# Altium schematic sheet ui_cpu_power.SchDoc: mcHF Pro Transceiver UI board
size A3; Author: Krassi Atanassov; CompanyName: MØNKA; Engineer: For radio amateurs experimentation, non-commercial use only. Thank you!; Revision: 0.8.5; SheetTotal: 13
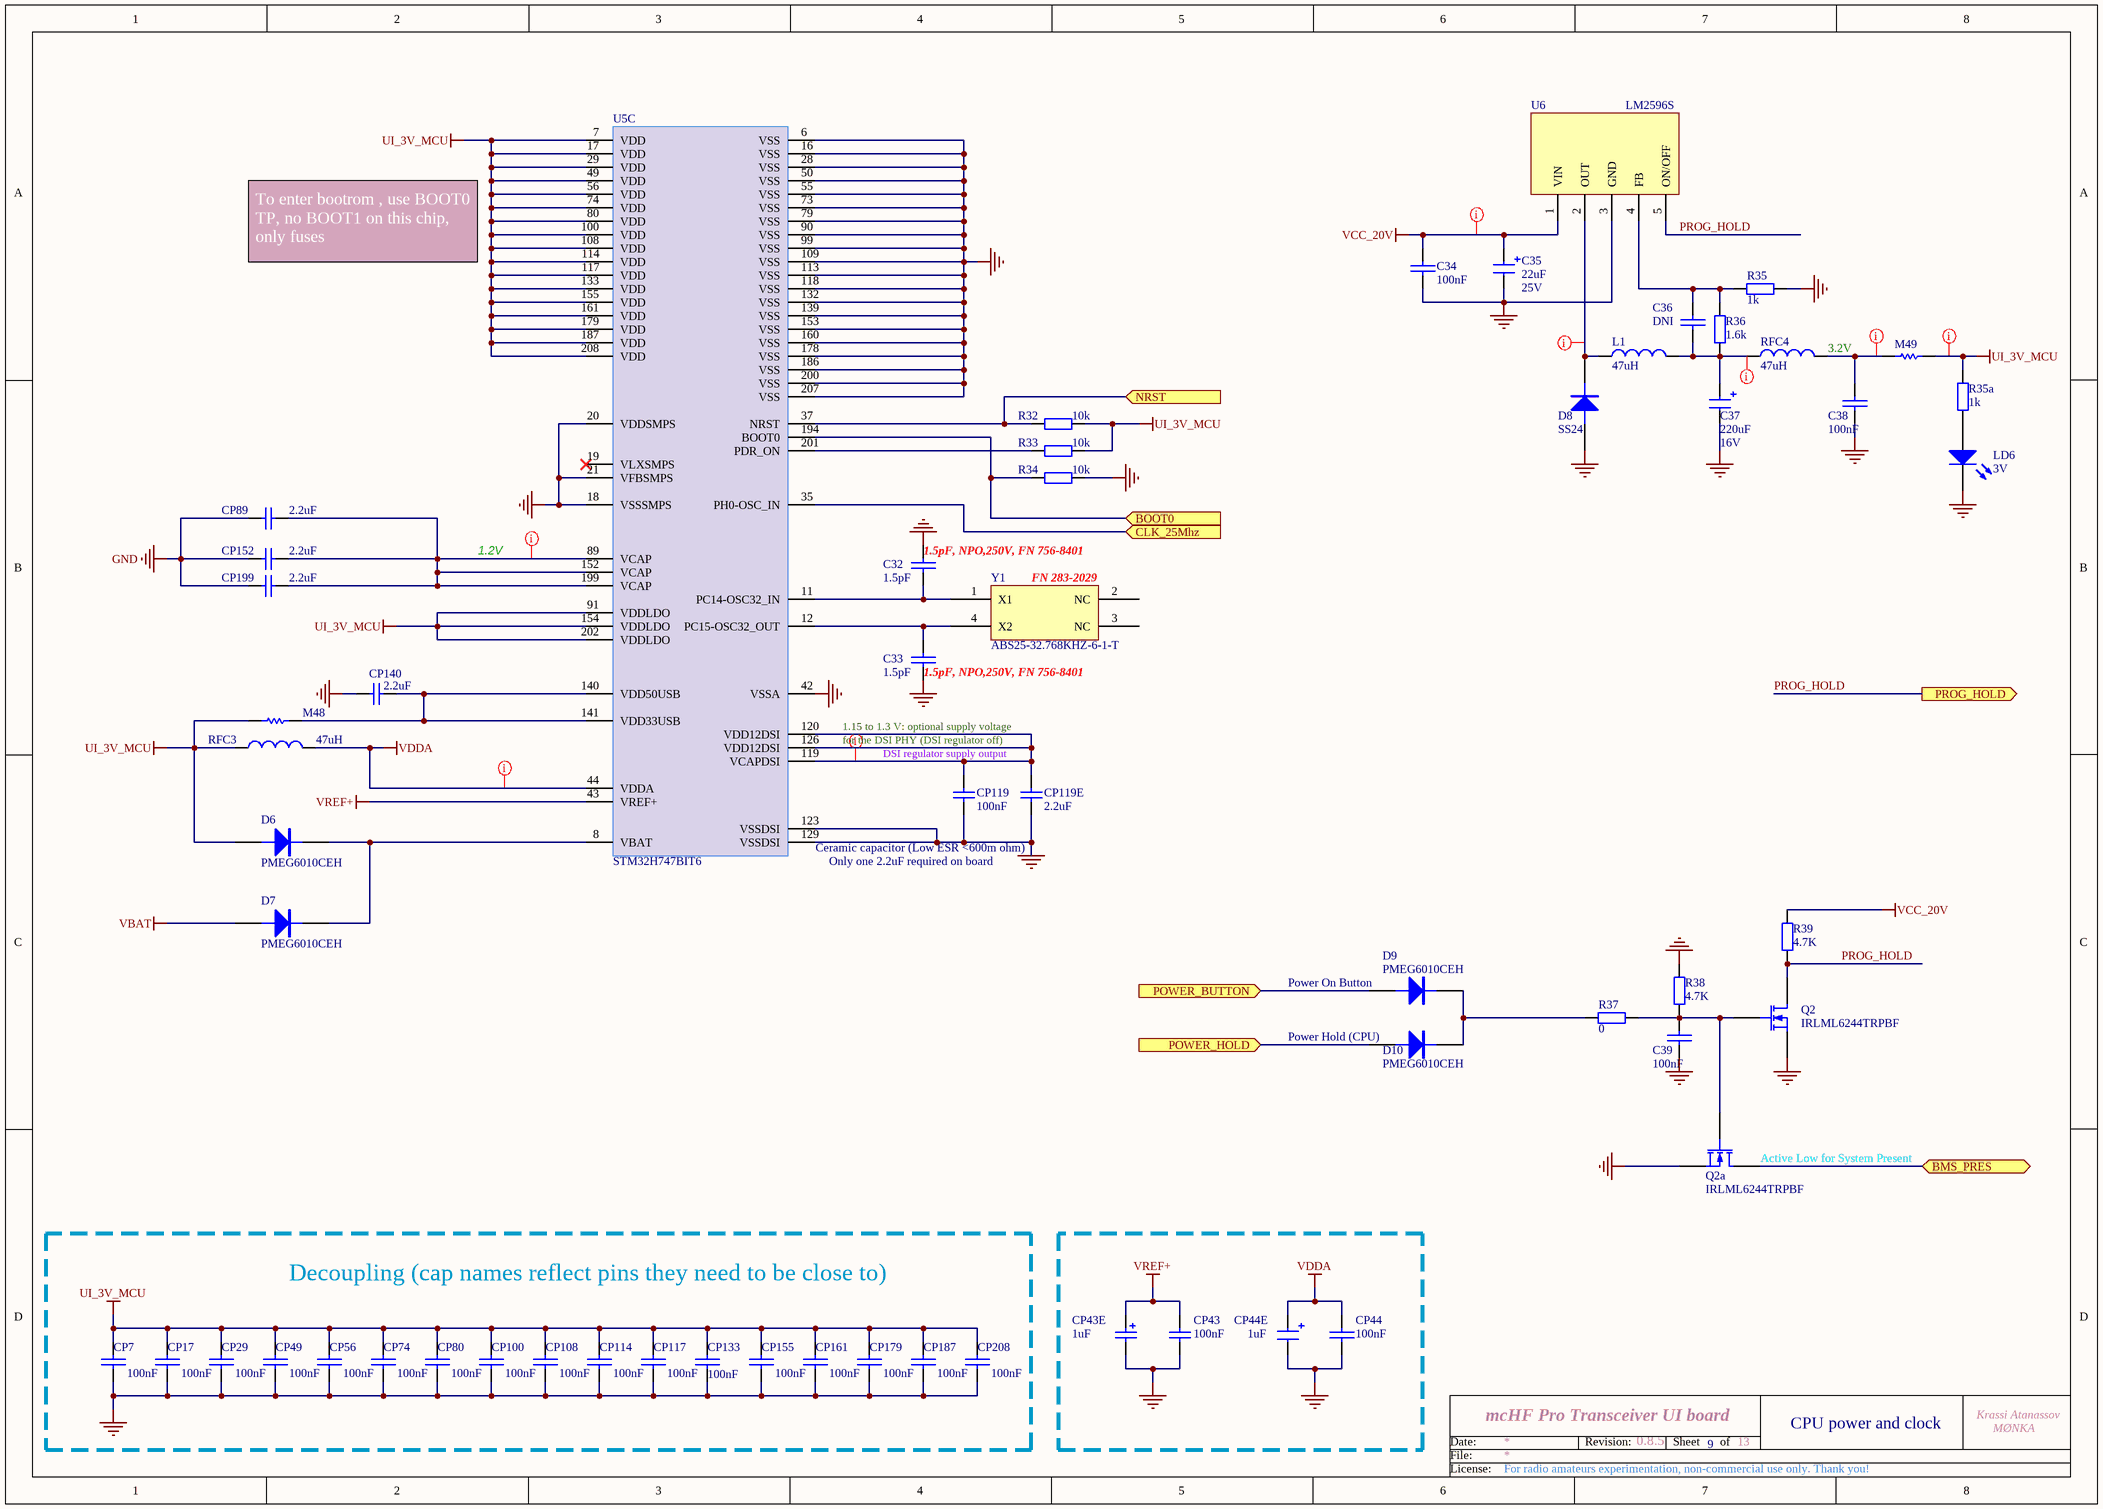
[diagram p0: ui_cpu_power.SchDoc]

## Parts
C32  1.5pF  [0805]
C33  1.5pF  [0805]
C34  100nF  [0805]
C35  22uF  Voltage: 25V  [1206_Elec_Cap]
C36  DNI  [0805]  (no BOM)
C37  220uF  Voltage: 16V  [CAP_ALUM_Pro]
C38  100nF  [0805]
C39  100nF  [0805]
CP7  100nF  [0805]
CP17  100nF  [0805]
CP29  100nF  [0805]
CP43  100nF  [0805]
CP43E  1uF  [1206_Elec_Cap]
CP44  100nF  [0805]
CP44E  1uF  [1206_Elec_Cap]
CP49  100nF  [0805]
CP56  100nF  [0805]
CP74  100nF  [0805]
CP80  100nF  [0805]
CP89  2.2uF  [0805]
CP100  100nF  [0805]
CP108  100nF  [0805]
CP114  100nF  [0805]
CP117  100nF  [0805]
CP119  100nF  [0805]
CP119E  2.2uF  [0805]
CP133  100nF  [0805]
CP140  2.2uF  [0805]
CP152  2.2uF  [0805]
CP155  100nF  [0805]
CP161  100nF  [0805]
CP179  100nF  [0805]
CP187  100nF  [0805]
CP199  2.2uF  [0805]
CP208  100nF  [0805]
D6  PMEG6010CEH  [SOD87]
D7  PMEG6010CEH  [SOD87]
D8  SS24  [DO214]
D9  PMEG6010CEH  [SOD87]
D10  PMEG6010CEH  [SOD87]
L1  47uH  [CD75]
LD6  3V  [1206_Elec_Cap]  (no BOM)
M48  0  [SB_0603]  (value not drawn)  (net tie, no BOM)
M49  0  [SB_0603]  (value not drawn)  (net tie, no BOM)
Q2  IRLML6244TRPBF  [SOT-23-Pro]
Q2a  IRLML6244TRPBF  [SOT-23-Pro]
R32  10k  [0805]
R33  10k  [0805]
R34  10k  [0805]
R35  1k  [0805]
R35a  1k  [0805]
R36  1.6k  [0805]
R37  0  [0805]
R38  4.7K  [0805]
R39  4.7K  [0805]
RFC3  47uH  [0805]
RFC4  47uH  [CD75]
U5  STM32H747BIT6  [LQFP208-28x28x1.4]  (part C of 3)
U6  LM2596S  [TO-263-5]
Y1  ABS25-32.768KHZ-6-1-T  [DSO-N4]

## Blocks framed on the sheet
Decoupling (cap names reflect pins they need to be close to): CP7 CP17 CP29 CP49 CP56 CP74 CP80 CP100 CP108 CP114 CP117 CP133 CP155 CP161 CP179 CP187 CP208

## Ports
BMS_PRES (bidir), BOOT0 (in), CLK_25Mhz (in), NRST (in), POWER_BUTTON (in), POWER_HOLD (in), PROG_HOLD (out)

## Nets
GND: C32.2 C33.1 C34.2 C35.2 C37.2 C38.2 C39.2 CP7.2 CP17.2 CP29.2 CP43.1 CP43E.2 CP44.2 CP44E.2 CP49.2 CP56.2 CP74.2 CP80.2 CP89.1 CP100.2 CP108.2 CP114.2 CP117.2 CP119.2 CP119E.2 CP133.2 CP140.2 CP152.1 CP155.2 CP161.2 CP179.2 CP187.2 CP199.1 CP208.2 D8.1(A) LD6.2(K) Q2.2(S) Q2a.2(S) R34.1 R35.2 R38.2 U5.6(VSS) U5.16(VSS) U5.18(VSSSMPS) U5.20(VDDSMPS) U5.21(VFBSMPS) U5.28(VSS) U5.42(VSSA) U5.50(VSS) U5.55(VSS) U5.73(VSS) U5.79(VSS) U5.90(VSS) U5.99(VSS) U5.109(VSS) U5.113(VSS) U5.118(VSS) U5.123(VSSDSI) U5.129(VSSDSI) U5.132(VSS) U5.139(VSS) U5.153(VSS) U5.160(VSS) U5.178(VSS) U5.186(VSS) U5.200(VSS) U5.207(VSS) U6.3(GND)
UI_3V_MCU: CP7.1 CP17.1 CP29.1 CP49.1 CP56.1 CP74.1 CP80.1 CP100.1 CP108.1 CP114.1 CP117.1 CP133.1 CP155.1 CP161.1 CP179.1 CP187.1 CP208.1 D6.1(A) M48.1 M49.2 R32.1 R33.1 R35a.2 RFC3.1 U5.7(VDD) U5.17(VDD) U5.29(VDD) U5.49(VDD) U5.56(VDD) U5.74(VDD) U5.80(VDD) U5.91(VDDLDO) U5.100(VDD) U5.108(VDD) U5.114(VDD) U5.117(VDD) U5.133(VDD) U5.154(VDDLDO) U5.155(VDD) U5.161(VDD) U5.179(VDD) U5.187(VDD) U5.202(VDDLDO) U5.208(VDD)
VBAT: D7.1(A)
VCC_20V: C34.1 C35.1 R39.2 U6.1(VIN)
VDDA: CP44.1 CP44E.1 RFC3.2 U5.44(VDDA)
VREF+: CP43.2 CP43E.1 U5.43(VREF+)
BMS_PRES: Q2a.3(D) ; port BMS_PRES
BOOT0: R34.2 U5.194(BOOT0) ; port BOOT0
CLK_25Mhz: U5.35(PH0-OSC_IN) ; port CLK_25Mhz
NRST: R32.2 U5.37(NRST) ; port NRST
POWER_BUTTON: D9.1(A) ; port POWER_BUTTON
POWER_HOLD: D10.1(A) ; port POWER_HOLD
PROG_HOLD: Q2.3(D) R39.1 U6.5(ON/OFF) ; port PROG_HOLD
NetC32_1: C32.1 U5.11(PC14-OSC32_IN) Y1.1(X1)
NetC33_2: C33.2 U5.12(PC15-OSC32_OUT) Y1.4(X2)
NetC36_1: C36.1 R35.1 R36.2 U6.4(FB)
NetC36_2: C36.2 C37.1 L1.2 R36.1 RFC4.1
NetC38_1: C38.1 M49.1 RFC4.2
NetC39_1: C39.1 Q2.1(G) Q2a.1(G) R37.2 R38.1
NetCP89_2: CP89.2 CP152.2 CP199.2 U5.89(VCAP) U5.152(VCAP) U5.199(VCAP)
NetCP119_1: CP119.1 CP119E.1 U5.119(VCAPDSI) U5.120(VDD12DSI) U5.126(VDD12DSI)
NetCP140_1: CP140.1 M48.2 U5.140(VDD50USB) U5.141(VDD33USB)
NetD6_2: D6.2(K) D7.2(K) U5.8(VBAT)
NetD8_2: D8.2(K) L1.1 U6.2(OUT)
NetD9_2: D9.2(K) D10.2(K) R37.1
NetLD6_1: LD6.1(A) R35a.1
NetR33_2: R33.2 U5.201(PDR_ON)

Not connected (* = marked no-connect by the designer): U5 19(VLXSMPS)*; Y1 2(NC) 3(NC)

## Layout directives
rule Width Constraint [Pref Width = 12mil    Min Width = 12mil    Max Width = 12mil]: NetCP89_2, NetCP119_1, UI_3V_MCU, VDDA
rule Width Constraint [Pref Width = 30mil    Min Width = 30mil    Max Width = 30mil]: NetC36_2, NetC38_1, NetD8_2, VCC_20V

## Notes on the sheet
- To enter bootrom , use BOOT0 TP, no BOOT1 on this chip, only fuses
- (near RFC4) 3.2V
- 1.2V
- (near C32) 1.5pF, NPO,250V, FN 756-8401
- (near Y1) FN 283-2029
- (near C33) 1.5pF, NPO,250V, FN 756-8401
- 1.15 to 1.3 V: optional supply voltage
- for the DSI PHY (DSI regulator off)
- DSI regulator supply output
- Ceramic capacitor (Low ESR <600m ohm)
- Only one 2.2uF required on board
- (near D9) Power On Button
- (near D10) Power Hold (CPU)
- (near Q2a) Active Low for System Present
- 6
- CPU power and clock
- Date:
- File:
- Revision:
- Sheet
- of
- License:

## Library data of the parts
C32 = CAP: Capacitor; Order: FN 756-8401; QT Order: QCC-00266; QT Price: 0.045; Price: 0.341
C33 = CAP: Capacitor; Order: FN 756-8401; QT Order: QCC-00266; Price: 0.341
C34 C36 C38 C39 = CAP: Capacitor; Voltage: 100V; QT Order: QCC-00154; Price: 0.068
C35 C37 = CAP-POL: Electrolitic capacitor; QT Order: QCC-00202; Price: 0.235
CP7 CP17 CP29 CP44 CP49 CP56 CP74 CP80 CP100 CP108 CP114 CP117 CP133 CP155 CP161 CP179 CP187 CP208 = CAP: Capacitor; Order: FN 282-1264; QT Order: QCC-00157; Price: 0.089
CP43 CP199 = Cap: Capacitor; Value: 10nF; Published: 8-Jun-2000; Revision: July-2002: Re-released for DXP Platform.; Publisher: Altium Limited
CP43E = Cap Pol1: Value: 10uF; Published: 8-Jun-2000; Revision: July-2002: Re-released for DXP Platform.; Publisher: Altium Limited
CP44E = CAP-POL: Electrolitic capacitor; Order: FN 145-7406; QT Order: QCC-00172; Price: 0.235
CP89 CP152 = cap: Capacitor; Value: 100nF; Ordered by: Subcon; ECCN_US/EU: NA; Fitted: NO; Notes: Ceramic capacitor, low ESR; Published: 8-Jun-2000; Revision: July-2002: Re-released for DXP Platform.; Publisher: Altium Limited
CP119 = CAP: Capacitor; Published: 8-Jun-2000; Revision: July-2002: Re-released for DXP Platform.; Publisher: Altium Limited; Value: 100nF
CP119E = CAP: Capacitor; Value: 100nF; Published: 8-Jun-2000; Revision: July-2002: Re-released for DXP Platform.; Publisher: Altium Limited
CP140 = CAP SMD 0603  X5R 1礔 25V 10%: 0603  X5R 1礔; Rated voltage: 25V; Tolerance: 10%; Manufacturer: *; Manufacturer P/N: *; Order code Farnell: 1288202RL; Value: 1礔; Power: *; Technology: X5R; Temperature  Factor: *; Temperature Max: +125癈; Temperature Min: -55癈; STS Code: *
D6-D10 = PMEG6010CEH: DIODE, SCHOTTKY, 1A, 60V, SOD-123F; QT Order: QCD-00034; Price: 0.085
L1 RFC4 = TDK-NLV25T: POWER INDUCTOR, 47UH, 1210; Price: 0.166; Notes: Power inductor
LD6 = LED2: LED 3mm; QT Order: QCD-00052; Revision: July-2002: Re-released for DXP Platform.; Price: 0.116
M48 M49 = Link: Value: 1K; Published: 8-Jun-2000; Revision: July-2002: Re-released for DXP Platform.; Publisher: Altium Limited
Q2 Q2a = MOSFET-N: N-Channel MOSFET; QT Order: QCT-00022; QT Price: 0.28; Price: 0.231
R32-R34 = RES: Resistor; Order: FN 146-9857; Price: 0.046
R35 R35a R39 = RES: Resistor; QT Order: QCR-00341; Price: 0.024
R36 = RES: Resistor; Order: 652-CR0805JW-162ELF; QT Order: QCR-00341; Price: 0.024
R37 R38 = RES: Resistor
RFC3 = Inductor: Value: 100uH; Published: 8-Jun-2000; Revision: July-2002: Re-released for DXP Platform.; Publisher: Altium Limited
U5 = STM32H747BIT6: STM32H747BIT6 LQFP208; Order: FN 248-4976; Price: 10.97
U6 = LM2596S: V REG ADJ +5/20V, SMPS TO-263-5; Notes: In bulk from Ali; Price: 1.28
Y1 = SmdCrystal: 32kHz Crystal; Order: FN 283-2029; Price: 0.34